# Altium schematic sheet Schematic.SchDoc
size A4
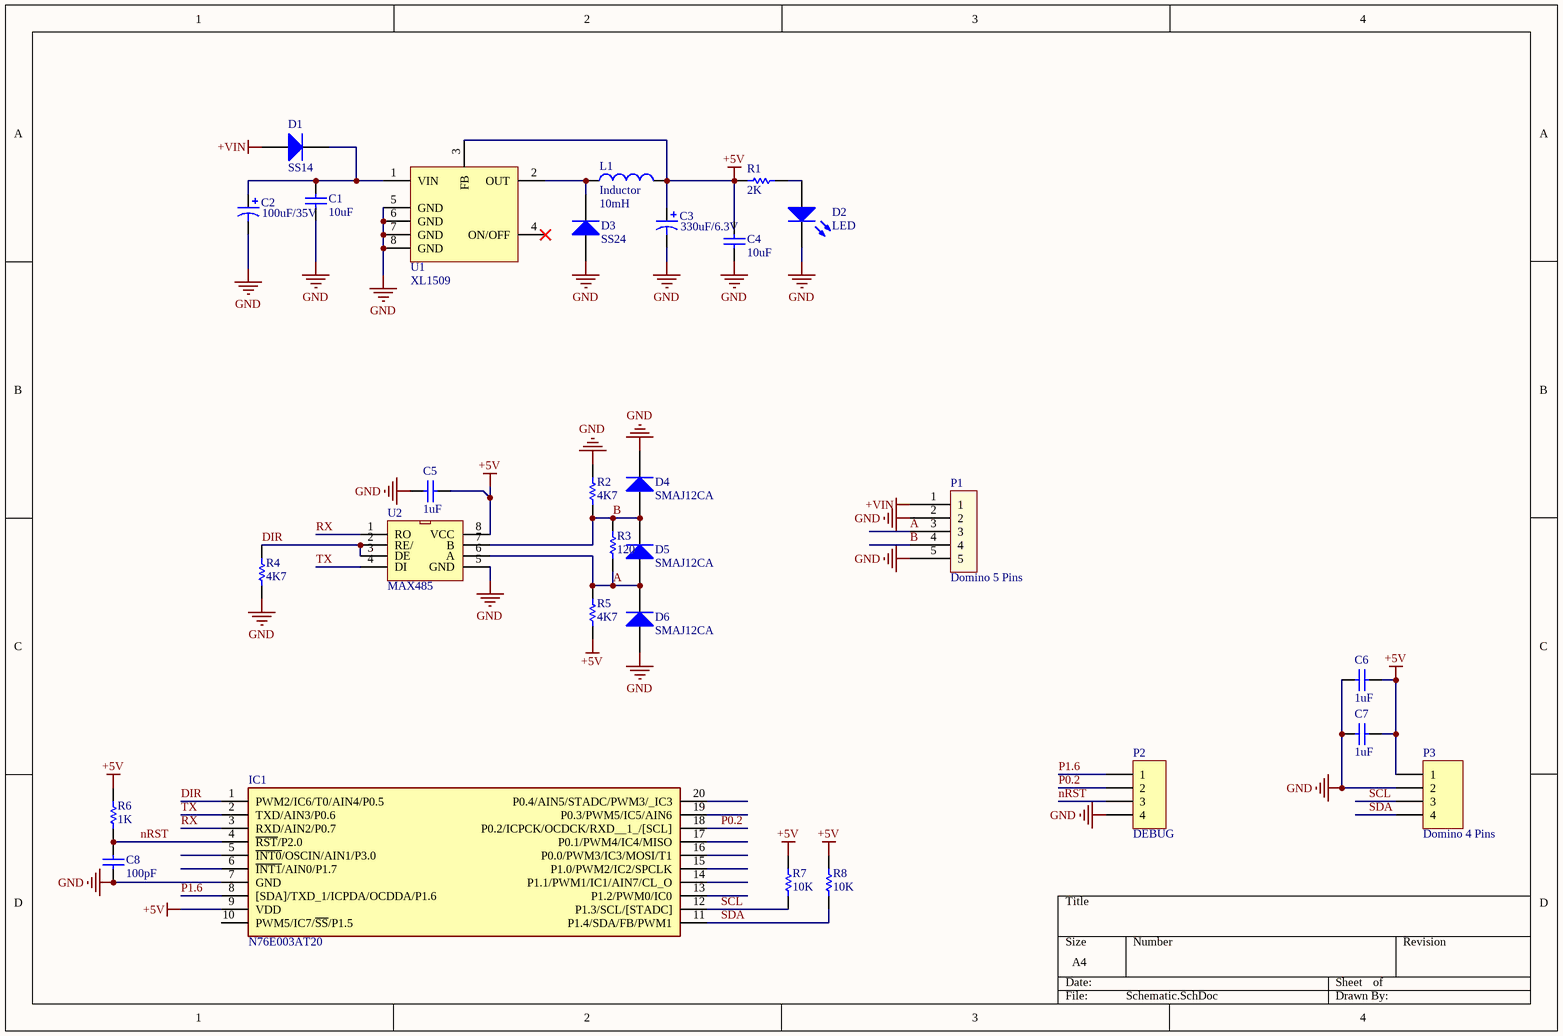
[diagram p0: Schematic.SchDoc]

## Parts
C1  10uF  [CAPC1608L]
C2  value 100uF/35V  [Tu Nhom SMD_D8 6.3x7.7mm]  (hidden comment: Cap Pol2)
C3  value 330uF/6.3V  [Tu Nhom SMD_D8 6.3x7.7mm]  (hidden comment: Cap Pol2)
C4  10uF  [CAPC1608L]
C5  1uF  [CAPC1608L]
C6  1uF  [CAPC1608L]
C7  1uF  [CAPC1608L]
C8  100pF  [CAPC1608L]
D1  SS14  [DO-214AC]
D2  LED  [LED_SMD_0805_GREEN]
D3  SS24  [DO-214AC]
D4  SMAJ12CA  [DO-214AC]
D5  SMAJ12CA  [DO-214AC]
D6  SMAJ12CA  [DO-214AC]
IC1  N76E003AT20  [SOP65P640X120-20N]
L1  Inductor  value 10mH  [INDC585232L_CD53]
P1  Domino 5 Pins  [DOMINO_5PIN_5.08MM]
P2  DEBUG  [HDR1X4]
P3  Domino 4 Pins  [DOMINO_4PIN_5.08mm]
R1  2K  [RESC1608L]
R2  4K7  [RESC1608L]
R3  120  [RESC1608L]
R4  4K7  [RESC1608L]
R5  4K7  [RESC1608L]
R6  1K  [RESC1608L]
R7  10K  [RESC1608L]
R8  10K  [RESC1608L]
U1  XL1509  [SOP8_L]
U2  MAX485  [SOP8_L]

## Nets
+5V: C3.1 C4.2 C5.1 C6.2 C7.2 IC1.9(VDD) L1.2 P3.1 R1.1 R5.1 R6.2 R7.2 R8.2 U1.3(FB) U2.8(VCC)
+VIN: D1.1(A) P1.1
GND: C1.1 C2.2 C3.2 C4.1 C5.2 C6.1 C7.1 C8.1 D2.2(K) D3.1(A) D4.2(K) D6.1(A) IC1.7(GND) P1.2 P1.5 P2.4 P3.2 R2.2 R4.1 U1.5(GND) U1.6(GND) U1.7(GND) U1.8(GND) U2.5(GND)
A: D5.1(A) D6.2(K) P1.3 R3.1 R5.2 U2.6(A)
B: D4.1(A) D5.2(K) P1.4 R2.1 R3.2 U2.7(B)
DIR: IC1.1(PWM2/IC6/T0/AIN4/P0.5) R4.2 U2.2(RE/) U2.3(DE)
nRST: C8.2 IC1.4(~{RST}/P2.0) P2.3 R6.1
P0.2: IC1.18(P0.2/ICPCK/OCDCK/RXD__1_/[SCL]) P2.2
P1.6: IC1.8([SDA]/TXD_1/ICPDA/OCDDA/P1.6) P2.1
RX: IC1.3(RXD/AIN2/P0.7) U2.1(RO)
SCL: IC1.12(P1.3/SCL/[STADC]) P3.3 R7.1
SDA: IC1.11(P1.4/SDA/FB/PWM1) P3.4 R8.1
TX: IC1.2(TXD/AIN3/P0.6) U2.4(DI)
NetC1_2: C1.2 C2.1 D1.2(K) U1.1(VIN)
NetD2_1: D2.1(A) R1.2
NetD3_2: D3.2(K) L1.1 U1.2(OUT)

Not connected (* = marked no-connect by the designer): IC1 5(~{INT0}/OSCIN/AIN1/P3.0) 6(~{INT1}/AIN0/P1.7) 10(PWM5/IC7/~{SS}/P1.5) 13(P1.2/PWM0/IC0) 14(P1.1/PWM1/IC1/AIN7/CL_O) 15(P1.0/PWM2/IC2/SPCLK) 16(P0.0/PWM3/IC3/MOSI/T1) 17(P0.1/PWM4/IC4/MISO) 19(P0.3/PWM5/IC5/AIN6) 20(P0.4/AIN5/STADC/PWM3/_IC3); U1 4(ON/OFF)*

## Library data of the parts
C1 C4-C8 = Cap: Capacitor; Published: 8-Jun-2000; LatestRevisionDate: 17-Jul-2002; LatestRevisionNote: Re-released for DXP Platform.; PackageReference: RAD-0.3; Publisher: Altium Limited
  C1 C4: Value: 10uF
  C5-C7: Value: 1uF
  C8: Value: 100pF
C2 C3 = Cap Pol2: Polarized Capacitor (Axial); Published: 8-Jun-2000; LatestRevisionDate: 17-Jul-2002; LatestRevisionNote: Re-released for DXP Platform.; PackageReference: POLAR0.8; Publisher: Altium Limited
D1 D3-D6 = Diode: Default Diode; Published: 8-Jun-2000; LatestRevisionDate: 17-Jul-2002; LatestRevisionNote: Re-released for DXP Platform.; PackageVersion: Sep-1996; PackageReference: SMC; Publisher: Altium Limited; Code_JEDEC: DO-214-AB
D2 = LED: Typical INFRARED GaAs LED; Published: 8-Jun-2000; LatestRevisionDate: 08-Jul-2005; LatestRevisionNote: Mech Layer 1 removed.; PackageReference: LED-0; Publisher: Altium Limited
IC1 = N76E003AT20: Integrated Circuit; Manufacturer_Name: Nuvoton; Datasheet Link: http://www.nuvoton.com/resource-files/DS_N76E003_EN_Rev1.00.pdf; Height: 1.2mm; Manufacturer_Part_Number: N76E003AT20; Arrow Part Number: N76E003AT20; Arrow Price/Stock: https://www.arrow.com/en/products/n76e003at20/nuvoton-technology
L1 = Inductor: Code_IEC: 1005; Published: 8-Jun-2000; LatestRevisionDate: 29-May-2009; LatestRevisionNote: IPC-7351 Footprint Added.; PackageReference: 0402-A; Publisher: Altium Limited; PackageDescription: Chip Inductor; Code_JEITA: 0402
P2 = Connector_4pin
P3 = Domino 4 pin
R1-R8 = Resistor: Semiconductor Resistor; Published: 8-Jun-2000; LatestRevisionDate: 17-Jul-2002; LatestRevisionNote: Re-released for DXP Platform.; PackageReference: AXIAL-0.5; Publisher: Altium Limited
  R1: Value: 2K
  R2 R4 R5: Value: 4K7
  R3: Value: 120
  R6: Value: 1K
  R7 R8: Value: 10K
U1 = XL1509: 2A 150KHz 40V Buck DC to DC Converter